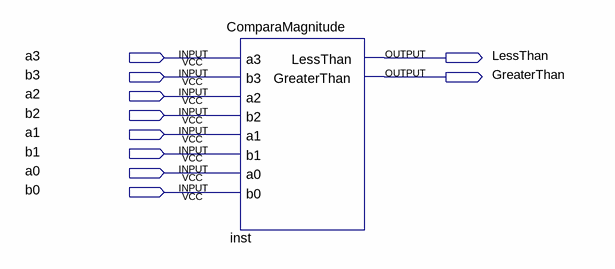
[diagram p0: schematic sheet]
// Quartus schematic Comparador.bdf as structural Verilog: 1 symbols, 10 pins
module Comparador (
  input  a3,
  input  b3,
  input  a2,
  input  b2,
  input  a1,
  input  b1,
  input  a0,
  input  b0,
  output LessThan,
  output GreaterThan
);

  ComparaMagnitude inst (
    .a3(a3), .b3(b3), .a2(a2), .b2(b2), .a1(a1), .b1(b1), .a0(a0), .b0(b0), .LessThan(LessThan),
    .GreaterThan(GreaterThan));
endmodule
